# Altium schematic sheet Procesador Auxiliar.SchDoc
size A4
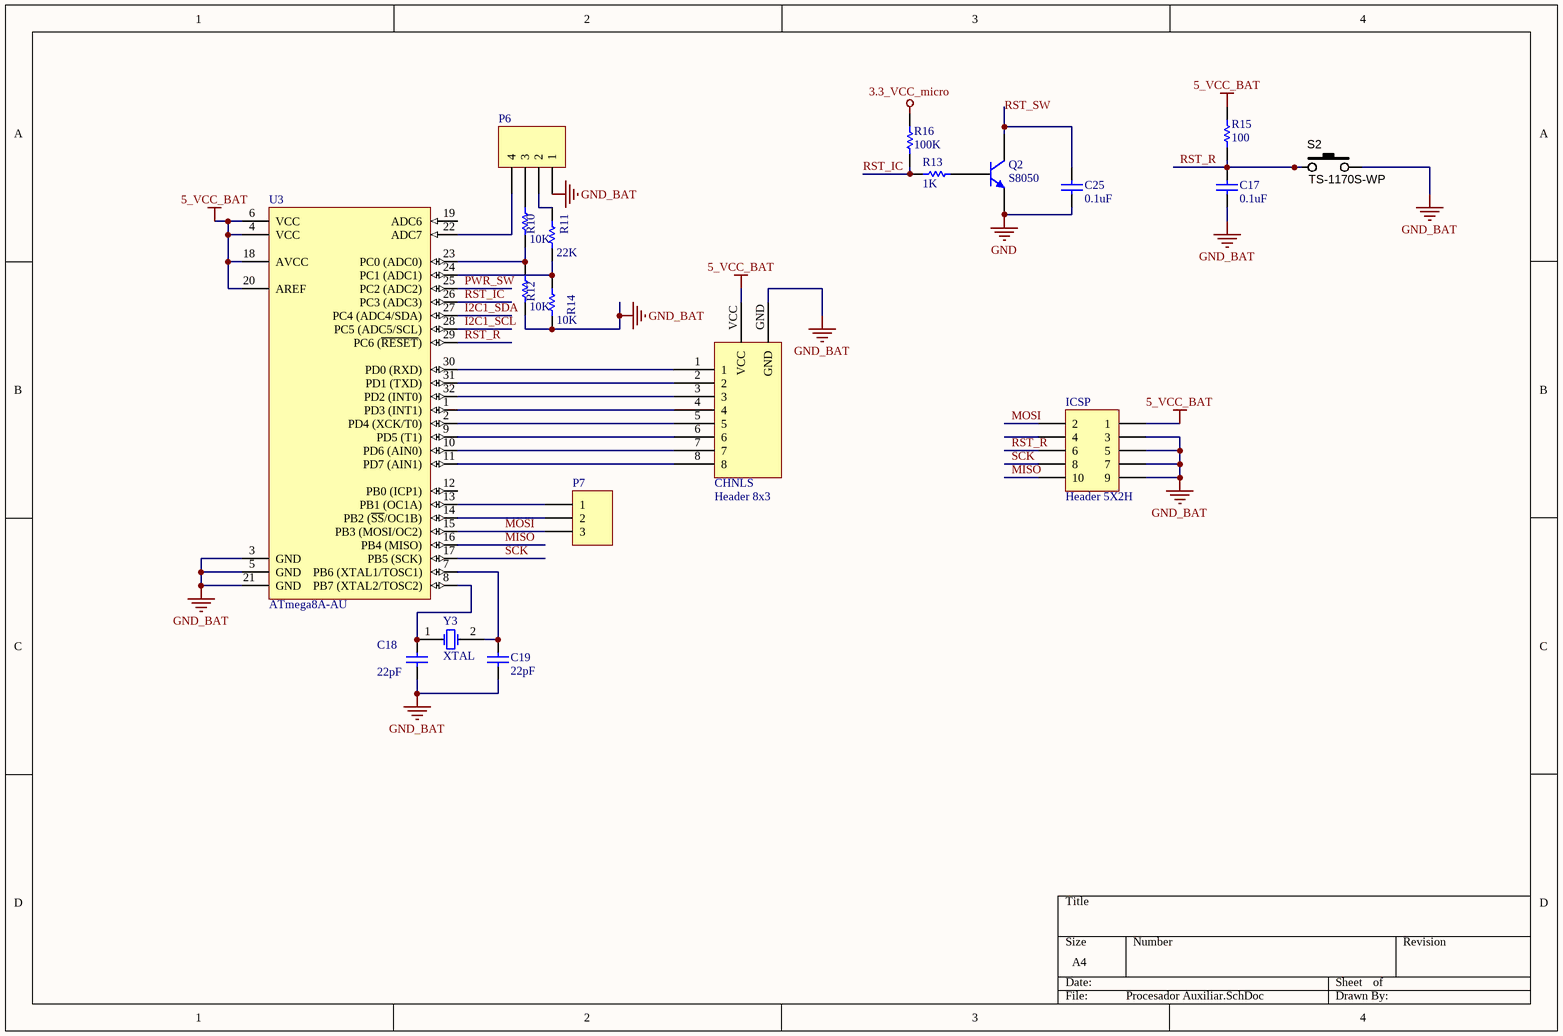
[diagram p0: Procesador Auxiliar.SchDoc]

## Parts
C17  value 0.1uF  [C0805]  (hidden comment: Cap)
C18  value 22pF  [6-0805_L]  (hidden comment: Cap Pol1)
C19  value 22pF  [6-0805_L]  (hidden comment: Cap Pol1)
C25  value 0.1uF  [C0805]  (hidden comment: Cap)
CHNLS  Header 8x3  [Header 8x3_mirror]
ICSP  Header 5X2H  [HDR2X5]
P6  Header 4  [HDR1X4]  (value not drawn)
P7  Header 3  [HDR1X3]  (value not drawn)
Q2  S8050  [SOT23-3]
R10  value 10K  [C0805]  (hidden comment: Res1)
R11  value 22K  [C0805]  (hidden comment: Res1)
R12  value 10K  [C1206]  (hidden comment: Res1)
R13  value 1K  [C0805]  (hidden comment: Res1)
R14  value 10K  [C0805]  (hidden comment: Res1)
R15  value 100  [C0805]  (hidden comment: Res1)
R16  value 100K  [C0805]  (hidden comment: Res1)
S2  TS-1170S-WP  [TS-1170S]
U3  ATmega8A-AU  [32A_N]
Y3  XTAL  [4SMX]

## Nets
3.3_VCC_micro: R16.1
5_VCC_BAT: CHNLS.VCC ICSP.1 R15.1 U3.4(VCC) U3.6(VCC) U3.18(AVCC) U3.20(AREF)
GND: C25.1 Q2.2(E)
GND_BAT: C17.1 C18.1 C19.1 CHNLS.GND ICSP.3 ICSP.5 ICSP.7 ICSP.9 P6.1 R12.1 R14.1 S2.2 U3.3(GND) U3.5(GND) U3.21(GND)
I2C1_SCL: U3.28(PC5_(ADC5/SCL))
I2C1_SDA: U3.27(PC4_(ADC4/SDA))
MISO: ICSP.10 U3.16(PB4_(MISO))
MOSI: ICSP.2 P7.3 U3.15(PB3_(MOSI/OC2))
PWR_SW: U3.25(PC2_(ADC2))
RST_IC: R13.2 R16.2 U3.26(PC3_(ADC3))
RST_R: C17.2 ICSP.6 R15.2 S2.1 U3.29(PC6_(~{RESET}))
RST_SW: C25.2 Q2.3(C)
SCK: ICSP.8 U3.17(PB5_(SCK))
NetC18_2: C18.2 U3.8(PB7_(XTAL2/TOSC2)) Y3.1(OSC1)
NetC19_2: C19.2 U3.7(PB6_(XTAL1/TOSC1)) Y3.2(OSC2)
NetCHNLS_1: CHNLS.1 U3.30(PD0_(RXD))
NetCHNLS_2: CHNLS.2 U3.31(PD1_(TXD))
NetCHNLS_3: CHNLS.3 U3.32(PD2_(INT0))
NetCHNLS_4: CHNLS.4 U3.1(PD3_(INT1))
NetCHNLS_5: CHNLS.5 U3.2(PD4_(XCK/T0))
NetCHNLS_6: CHNLS.6 U3.9(PD5_(T1))
NetCHNLS_7: CHNLS.7 U3.10(PD6_(AIN0))
NetCHNLS_8: CHNLS.8 U3.11(PD7_(AIN1))
NetP6_2: P6.2 R11.2
NetP6_3: P6.3 R10.2
NetP6_4: P6.4 U3.22(ADC7)
NetP7_1: P7.1 U3.13(PB1_(OC1A))
NetP7_2: P7.2 U3.14(PB2_(~{SS}/OC1B))
NetQ2_1: Q2.1(B) R13.1
NetR10_1: R10.1 R12.2 U3.23(PC0_(ADC0))
NetR11_1: R11.1 R14.2 U3.24(PC1_(ADC1))

Not connected (* = marked no-connect by the designer): ICSP 4; U3 12(PB0_(ICP1)) 19(ADC6)

## Library data of the parts
C17-C19 C25 = Cap: Capacitor; Published: 8-Jun-2000; LatestRevisionDate: 17-Jul-2002; LatestRevisionNote: Re-released for DXP Platform.; PackageReference: RAD-0.3; Publisher: Altium Limited; PackageDescription: Radial Cap, Thru-Hole; 2 Leads; 0.3 in Pin Spacing
ICSP = Header 5X2H: Header, 5-Pin, Dual row, Right Angle; LatestRevisionDate: 17-Jul-2002; LatestRevisionNote: Re-released for DXP Platform.; Publisher: Altium Limited
P6 = Header 4: Header, 4-Pin; LatestRevisionDate: 17-Jul-2002; LatestRevisionNote: Re-released for DXP Platform.; Publisher: Altium Limited
P7 = Header 3: Header, 3-Pin; LatestRevisionDate: 17-Jul-2002; LatestRevisionNote: Re-released for DXP Platform.; Publisher: Altium Limited
Q2 = S8050: NPN SMD General Purpose Amplifier; Published: 8-Jun-2000; LatestRevisionDate: 15-Jan-2003; LatestRevisionNote: PCB Footprint 'BCY-W3/D4.7' replaced; DatasheetVersion: 1997; PackageVersion: Sep-1998; PackageReference: TO-92A; Publisher: Altium Limited; PackageDescription: TO, Flat Index; 3 In-Line, Axial Leads; Body Dia. 4.5mm; Leads 0.51 x 0.48 mm (max); ComponentLink1Description: Manufacturer Link; ComponentLink1URL: http://www.fairchildsemi.com/; ComponentLink2Description: Datasheet; ComponentLink2URL: http://www.fairchildsemi.com/ds/2N%2F2N3904.pdf
R10-R16 = Res1: Resistor; Published: 8-Jun-2000; LatestRevisionDate: 17-Jul-2002; LatestRevisionNote: Re-released for DXP Platform.; PackageReference: AXIAL-0.3; Publisher: Altium Limited; PackageDescription: Axial Device, Thru-Hole; 2 Leads; 0.3 in Pin Spacing
S2 = SW_SMD_PB_7.0mm: Switch SMD Tact 7.0mm Stem; Manufacturer 1: Bond-Tact; Manufacturer Part Number 1: TS-1170S-WP-200; SCDType: source; Function: On/Off; Package / Case: 6.5x6.5mm; 7.0mm stem; ComponentLink1URL: http://www.bondtact.com.hk/zaspx/productd.aspx?catno=3&subcatid=3&PageNo=2&productno=40; ComponentLink1Description: http://www.bondtact.com.hk/zaspx/productd.aspx?catno=3&subcatid=3&PageNo=2&productno=40
U3 = ATmega8A-AU: 8-bit AVR Microcontroller, 8KB Flash, 512 Bytes EEPROM, 1KB SRAM, 32-pin TQFP, Industrial Grade (-40°C to 85°C); Published: 1-Apr-2010; DatasheetVersion: revC, Jul-2009; PackageVersion: revB, Oct-2001; PackageReference: 32A; Publisher: Altium Limited; PackageDescription: 32-Lead, 7x7x1.0 mm Body, 0.8mm Lead Pitch, Thin Profile Plastic Quad Flat Package (TQFP); Supplier 1: Digi-Key; Supplier Part Number 1: ATMEGA8A-AU-ND; Supplier 2: Farnell; Supplier Part Number 2: 1748532; Supplier 3: Mouser; Supplier Part Number 3: 556-ATMEGA8A-AU; Code_JEDEC: MS-026-ABA; ComponentLink1Description: Manufacturer Link; ComponentLink1URL: http://www.atmel.com/products/avr/default.asp?; ComponentLink2Description: ATmega8A Datasheet; ComponentLink2URL: http://www.atmel.com/dyn/resources/prod_documents/doc8159.pdf; ComponentLink3Description: ATmega8A Summary; ComponentLink3URL: http://www.atmel.com/dyn/resources/prod_documents/8159S.pdf; ComponentLink4Description: Atmel.com Home; ComponentLink4URL: http://www.atmel.com
Y3 = XTAL: Crystal Oscillator; Published: 8-Jun-2000; LatestRevisionDate: 17-Jul-2002; LatestRevisionNote: Re-released for DXP Platform.; PackageReference: R38; Publisher: Altium Limited; PackageDescription: Crystal, Thru-Hole; 2 Leads; Body 3.1 x 8.2 mm (Dia.xH)